# EAGLE schematic interupt (EAGLE 6.4)
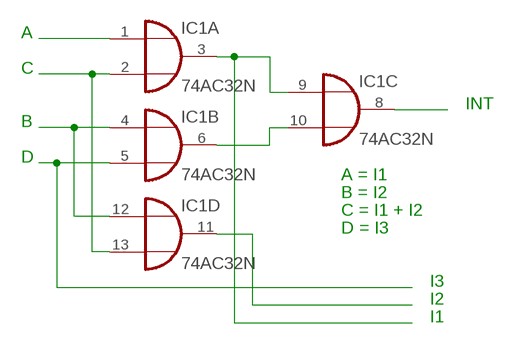
[diagram p0: schematic, sheet 1]

## Parts
IC1  74AC32N  [DIL14]

## Nets
N$1: IC1.5(B:I1)
N$2: IC1.4(B:I0) IC1.12(D:I0)
N$3: IC1.2(A:I1) IC1.13(D:I1)
N$4: IC1.1(A:I0)
N$5: IC1.3(A:O) IC1.9(C:I0)
N$6: IC1.6(B:O) IC1.10(C:I1)
N$7: IC1.11(D:O)
N$8: IC1.8(C:O)

## Notes on the sheet
- A
- C
- INT
- B
- D
- A = I1
- B = I2
- C = I1 + I2
- D = I3
- I3
- I2
- I1

## Power pins joined to a net without a drawn wire
GND: IC1.7(P:GND)
VCC: IC1.14(P:VCC)

## Library data of the parts
IC1 = 74xx-eu:74*32: Quad 2-input OR gate